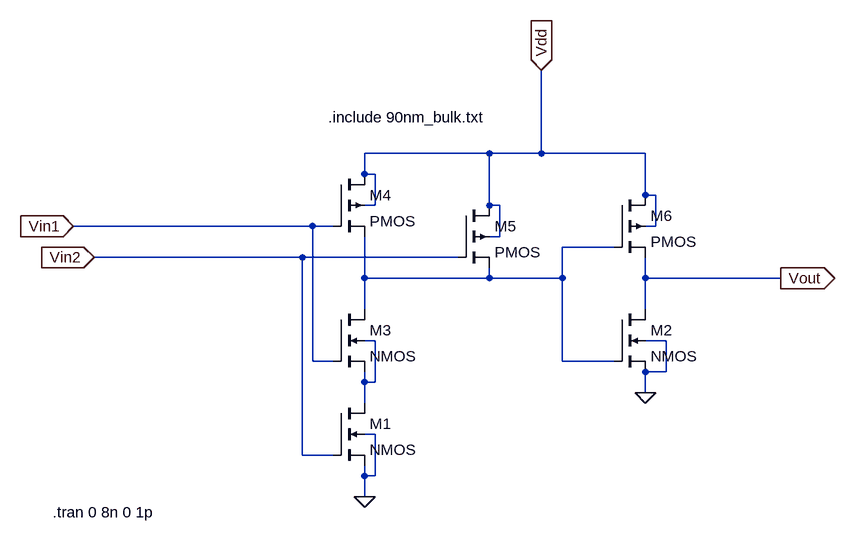
[diagram p0: schematic and.asc]
and.asc, the LTspice schematic file:
Version 4
SHEET 1 968 680
WIRE 352 64 160 64
WIRE 432 64 432 -64
WIRE 432 64 352 64
WIRE 592 64 432 64
WIRE 160 96 160 64
WIRE 176 96 160 96
WIRE 592 128 592 64
WIRE 608 128 592 128
WIRE 176 144 176 96
WIRE 176 144 160 144
WIRE 352 144 352 64
WIRE 368 144 352 144
WIRE 80 176 -288 176
WIRE 112 176 80 176
WIRE 608 176 608 128
WIRE 608 176 592 176
WIRE 368 192 368 144
WIRE 368 192 352 192
WIRE 544 208 464 208
WIRE 64 224 -256 224
WIRE 304 224 64 224
WIRE 160 256 160 192
WIRE 352 256 352 240
WIRE 352 256 160 256
WIRE 464 256 464 208
WIRE 464 256 352 256
WIRE 592 256 592 224
WIRE 800 256 592 256
WIRE 160 304 160 256
WIRE 592 304 592 256
WIRE 176 352 160 352
WIRE 624 352 592 352
WIRE 80 384 80 176
WIRE 112 384 80 384
WIRE 464 384 464 256
WIRE 544 384 464 384
WIRE 624 400 624 352
WIRE 624 400 592 400
WIRE 160 416 160 400
WIRE 176 416 176 352
WIRE 176 416 160 416
WIRE 592 432 592 400
WIRE 160 448 160 416
WIRE 176 496 160 496
WIRE 64 528 64 224
WIRE 112 528 64 528
WIRE 160 560 160 544
WIRE 176 560 176 496
WIRE 176 560 160 560
WIRE 160 592 160 560
FLAG -288 176 Vin1
IOPIN -288 176 In
FLAG -256 224 Vin2
IOPIN -256 224 In
FLAG 800 256 Vout
IOPIN 800 256 Out
FLAG 432 -64 Vdd
IOPIN 432 -64 In
FLAG 160 592 0
FLAG 592 432 0
SYMBOL nmos4 112 448 R0
SYMATTR InstName M1
SYMATTR Value2 l=90n w=200n
SYMBOL nmos4 544 304 R0
SYMATTR InstName M2
SYMATTR Value2 l=90n w=200n
SYMBOL nmos4 112 304 R0
SYMATTR InstName M3
SYMATTR Value2 l=90n w=200n
SYMBOL pmos4 112 96 R0
SYMATTR InstName M4
SYMATTR Value2 l=90n w=400n
SYMBOL pmos4 304 144 R0
SYMATTR InstName M5
SYMATTR Value2 l=90n w=400n
SYMBOL pmos4 544 128 R0
SYMATTR InstName M6
SYMATTR Value2 l=90n w=400n
TEXT 104 8 Left 2 !.include 90nm_bulk.txt
TEXT -320 616 Left 2 !.tran 0 8n 0 1p

The netlist it stands for:
* and.asc
M1 N002 Vin2 0 0 NMOS l=90n w=200n
M2 Vout N001 0 0 NMOS l=90n w=200n
M3 N001 Vin1 N002 N002 NMOS l=90n w=200n
M4 Vdd Vin1 N001 Vdd PMOS l=90n w=400n
M5 Vdd Vin2 N001 Vdd PMOS l=90n w=400n
M6 Vdd N001 Vout Vdd PMOS l=90n w=400n
.model NMOS NMOS
.model PMOS PMOS
.lib standard.mos
.include 90nm_bulk.txt
.tran 0 8n 0 1p
.backanno
.end